# Altium schematic sheet LaserDiode.SchDoc
size Tabloid; Organization: MIT; SheetNumber: 4; SheetTotal: 5; Section: Laser Diode
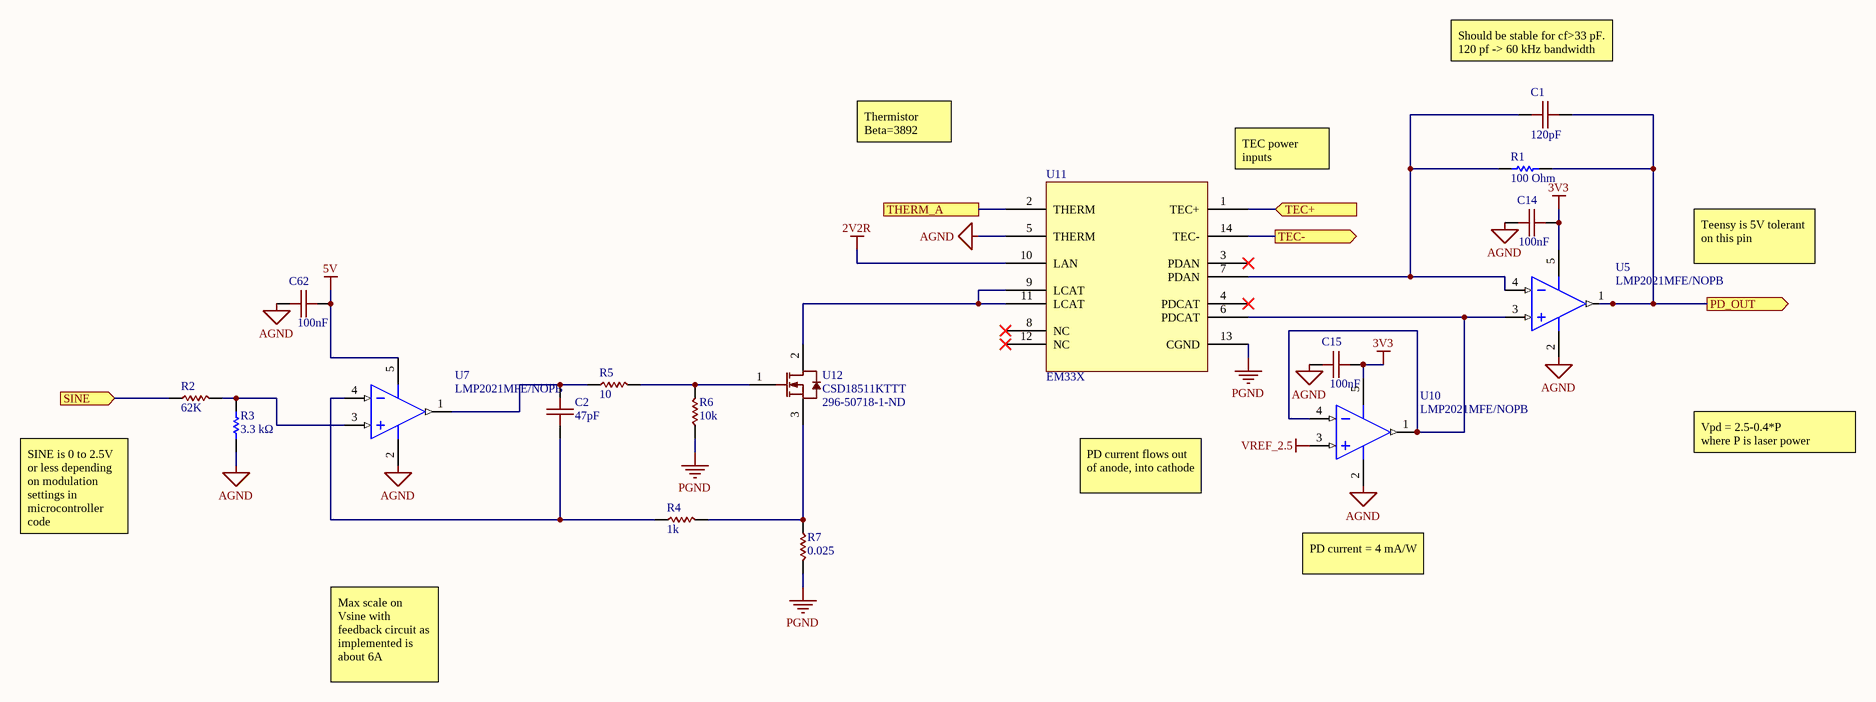
[diagram p0: LaserDiode.SchDoc]

## Parts
C1  120pF  [0603 B]
C2  47pF  [0603 B]
C14  100nF  [0603 B]
C15  100nF  [0603 B]
C62  100nF  [0603 B]
R1  100 Ohm  [RESC1608X55X30LL15T15]
R2  62K  [0805]
R3  3.3 kΩ  [RESC2013X70X40ML20T20]
R4  1k  [0805]
R5  10  [0805]
R6  10k  [0805]
R7  0.025  [1206]
U5  LMP2021MFE/NOPB  [DBV0005A_N]
U7  LMP2021MFE/NOPB  [DBV0005A_N]
U10  LMP2021MFE/NOPB  [DBV0005A_N]
U11  EM33X  [EM33X]
U12  CSD18511KTTT  Supplier Part Number 1: 296-50718-1-ND  [DPAK254P1510X470-3N]

## Ports
PD_OUT (out), SINE (in), TEC+ (in), TEC- (out), THERM_A

## Nets
2V2R: U11.10(LAN)
3V3: C14.1 C15.1 U5.5(V+) U10.5(V+)
5V: C62.1 U7.5(V+)
AGND: C14.2 C15.2 C62.2 R3.1 U5.2(V-) U7.2(V-) U10.2(V-) U11.5(THERM)
PGND: R6.2 R7.1 U11.13(CGND)
VREF_2.5: U10.3(IN+)
PD_OUT: C1.1 R1.2 U5.1(OUT) ; port PD_OUT
SINE: R2.2 ; port SINE
TEC+: U11.1(TEC+) ; port TEC+
TEC-: U11.14(TEC-) ; port TEC-
THERM_A: U11.2(THERM) ; port THERM_A
NetC1_2: C1.2 R1.1 U5.4(IN-) U11.7(PDAN)
NetC2_1: C2.1 R4.2 U7.4(IN-)
NetC2_2: C2.2 R5.2 U7.1(OUT)
NetR2_1: R2.1 R3.2 U7.3(IN+)
NetR4_1: R4.1 R7.2 U12.3(S)
NetR5_1: R5.1 R6.1 U12.1(G)
NetU5_3: U5.3(IN+) U10.1(OUT) U10.4(IN-) U11.6(PDCAT)
NetU11_9: U11.9(LCAT) U11.11(LCAT) U12.2(D)

Not connected (* = marked no-connect by the designer): U11 3(PDAN)* 4(PDCAT)* 8(NC)* 12(NC)*

## Notes on the sheet
- Should be stable for cf>33 pF. 120 pf -> 60 kHz bandwidth
- Thermistor Beta=3892
- (near U11) TEC power inputs
- Teensy is 5V tolerant on this pin
- Vpd = 2.5-0.4*P
  where P is laser power
- SINE is 0 to 2.5V or less depending on modulation settings in microcontroller code
- PD current flows out of anode, into cathode
- PD current = 4 mA/W
- Max scale on Vsine with feedback circuit as implemented is about 6A
- Title
- Size
- Date
- Tabloid
- Section
- Time
- Sheet
- of
- Revision
- Drawn
- 33-207 / 77 Mass. Ave.
- Cambridge, MA 02139
- File

## Library data of the parts
C1 = CAP 0603: Cap Ceramic 120pF 50V C0G 5% SMD 0603 125°C Paper T/R; Manufacturer: KEMET; Manufacturer Part Number: C0603C121J5GACTU; Dissipation Factor: 0.1%; Temperature Coefficient: 30ppm/°C; Value: 120pF; Supplier 1: Digi-Key; Supplier Part Number 1: 399-C0603C121J5GAC7867CT-ND; RoHS: Yes; Category: Ceramic Capacitors; Stock 1: 134212; Pricing 1: 1=0.10000, 10=0.04900, 50=0.02660, 100=0.02180, 500=0.01556, 1000=0.01222 (USD); Mount: Surface Mount,PCB; Case/Package: 0603; Number of Pins: 2; Case Code (Metric): 1608; Case Code (Imperial): 0603; Dielectric Material: Ceramic; Contact Material: Tin; Contact Plating: Tin,Matte; Min Operating Temperature: -55°C; Max Operating Temperature: 125°C; Capacitance: 120pF; Tolerance: 5%; Voltage Rating: 50V; Voltage Rating (DC): 50V; Packaging: Tape and Reel; Dielectric: C0G; Series: C; Package Quantity: 1; Termination: SMD/SMT; Construction: Flat; Voltage: 50V; Length: 1.6mm; Width: 0.8mm; Height: 0.8mm; Thickness: 0.034inch; Depth: 0.8mm; Lead Pitch: 0.7mm; Radiation Hardening: No; RoHS Compliant: Yes; Lead Free: Lead Free; Reach SVHC Compliant: Yes; ComponentLink1URL: https://datasheet.ciiva.com/144/docfinderpartnumber-c0603c121j5gactu-144406.pdf?src-supplier=Digi-Key; ComponentLink1Description: https://datasheet.ciiva.com/144/docfinderpartnumber-c0603c121j5gactu-144406.pdf?src-supplier=Digi-Key; ComponentLink2URL: https://datasheet.ciiva.com/14610/70095383-14610090.pdf?src-supplier=Allied+Electronics; ComponentLink2Description: https://datasheet.ciiva.com/14610/70095383-14610090.pdf?src-supplier=Allied+Electronics; ComponentLink3URL: https://datasheet.ciiva.com/5417/kem-c1003-c0g-smd-356956-5417613.pdf?src-supplier=Mouser; ComponentLink3Description: https://datasheet.ciiva.com/5417/kem-c1003-c0g-smd-356956-5417613.pdf?src-supplier=Mouser; ComponentLink4URL: https://datasheet.ciiva.com/18192/getdatasheetpartid-462848-18192773.pdf?src-supplier=Verical; ComponentLink4Description: https://datasheet.ciiva.com/18192/getdatasheetpartid-462848-18192773.pdf?src-supplier=Verical
C2 C14 C15 C62 = CAP 0603: 603 Capacitor
  C2: Value: 47pF
  C14 C15 C62: Value: 100nF
R1 = CMP-2000-00179-1: Manufacturer: Panasonic; Part Number: ERJ-3EKF1000V
R2 R4-R6 = RES 0805: 805 Resistor
  R2: Value: 62K
  R4: Value: 1k
  R5: Value: 10
  R6: Value: 10k
R3 = CMP-2001-00533-1: Manufacturer: Panasonic; Part Number: ERJ6ENF3301V; Resistance: 3.3 kΩ
R7 = RES 1206: 1206 Resistor; Value: 0.025
U5 U7 U10 = CMP-0055-01233-3: Zero Drift, Low Noise, EMI Hardened Amplifier, 5-pin SOT-23, Pb-Free; Manufacturer: Texas Instruments; PowerWise: N; CompType: Amplifiers; PackageTopMarking: AF5A*XTT; PackageDescription: Molded SOT-23, .115 x .063 x .040 in Body, 5 Lead, .0375 in Pitch; PinCount: 5; RoHS: Y; Package Reference: DBV0005A; ComponentLink1URL: http://www.ti.com/general/docs/lit/getliterature.tsp?genericPartNumber=LMP2021&fileType=pdf; ComponentLink1Description: Datasheet URL
U11 = EM33X: 5W Cooled 9XX Multimode Lasers in 14-Pin Package
U12 = CSD18511KTT: 40-V, N channel NexFET™ power MOSFET, single D2PAK, 2.6 mOhm; Vendor: Texas Instruments; Built_By: EMA_Jessica; SourceLibrary: TI_2019-05-10; Manufacturer_Part_Number: CSD18511KTT; Copyright: Copyright (C) 2018 Accelerated Designs. All rights reserved; RefDes: RefDes; Type: DEV; Supplier 1: Digi-Key